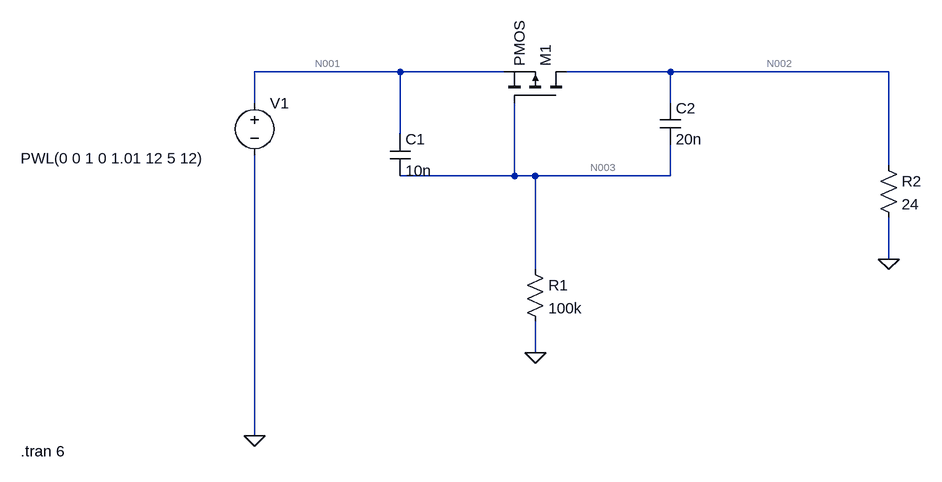
[diagram p0: schematic Piste_Soft_Start.asc]
Piste_Soft_Start.asc, the LTspice schematic file:
Version 4.1
SHEET 1 1272 680
WIRE 272 32 48 32
WIRE 432 32 272 32
WIRE 688 32 528 32
WIRE 1024 32 688 32
WIRE 48 80 48 32
WIRE 688 80 688 32
WIRE 272 128 272 32
WIRE 1024 176 1024 32
WIRE 448 192 448 80
WIRE 448 192 272 192
WIRE 480 192 448 192
WIRE 688 192 688 144
WIRE 688 192 480 192
WIRE 1024 320 1024 256
WIRE 480 336 480 192
WIRE 480 464 480 416
WIRE 48 592 48 160
FLAG 480 464 0
FLAG 48 592 0
FLAG 1024 320 0
SYMBOL voltage 48 64 R0
WINDOW 3 -360 101 Left 2
WINDOW 123 0 0 Left 0
WINDOW 39 0 0 Left 0
SYMATTR InstName V1
SYMATTR Value PWL(0 0 1 0 1.01 12 5 12)
SYMBOL pmos 528 80 M270
SYMATTR InstName M1
SYMBOL cap 256 128 R0
SYMATTR InstName C1
SYMATTR Value 10n
SYMBOL cap 672 80 R0
SYMATTR InstName C2
SYMATTR Value 20n
SYMBOL res 464 320 R0
SYMATTR InstName R1
SYMATTR Value 100k
SYMBOL res 1008 160 R0
SYMATTR InstName R2
SYMATTR Value 24
TEXT -312 616 Left 2 !.tran 6

The netlist it stands for:
* Piste_Soft_Start.asc
V1 N001 0 PWL(0 0 1 0 1.01 12 5 12)
M1 N002 N003 N001 N001 PMOS
C1 N001 N003 10n
C2 N002 N003 20n
R1 N003 0 100k
R2 N002 0 24
.model NMOS NMOS
.model PMOS PMOS
.lib standard.mos
.tran 6
.backanno
.end

* Results of the author's LTspice run, read from the files saved beside the schematic
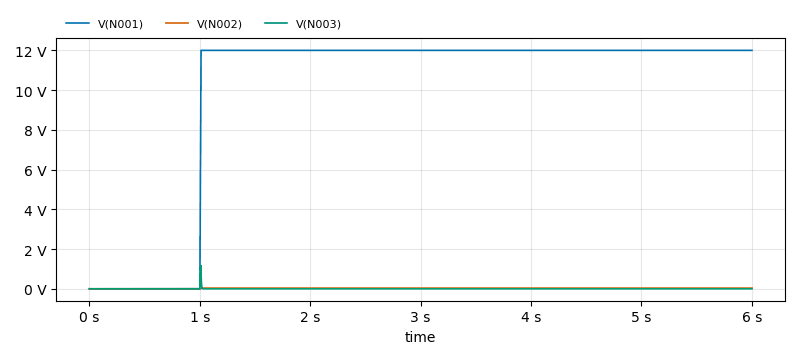
[diagram p1: Transient Analysis of Piste_Soft_Start.asc, plotted from the saved traces]
* Transient Analysis, 1 run:
*   V(N001): min 0 V, max 12 V, average 9.99 V, rms 10.95 V, last 12 V
*   V(N002): min 0 V, max 34.56 mV, average 28.75 mV, rms 31.52 mV, last 34.56 mV
*   V(N003): min -164.7 nV, max 1.17 V, average 2.012 mV, rms 41.71 mV, last 0 V